# Altium schematic sheet SD Card.SchDoc
size B; DrawnBy: Ross Harvey; Engineer: Ross Harvey; Revision: A; SheetNumber: 7
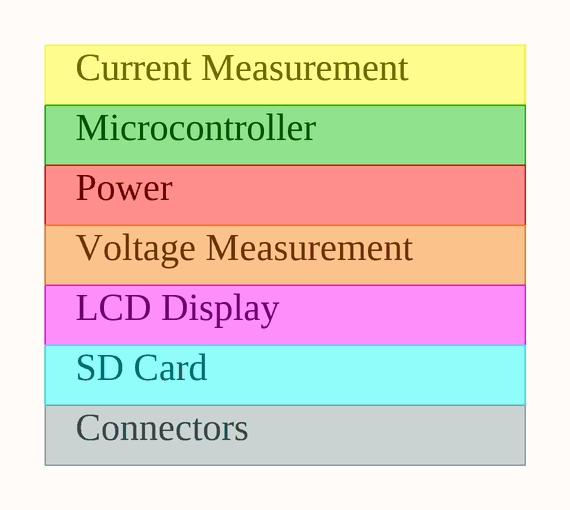
[diagram p0: SD Card.SchDoc]

## Notes on the sheet
- Current Measurement
- Microcontroller
- Power
- Voltage Measurement
- LCD Display
- SD Card
- Connectors